# Altium project efm8sb1-dev-board.PrjPcb
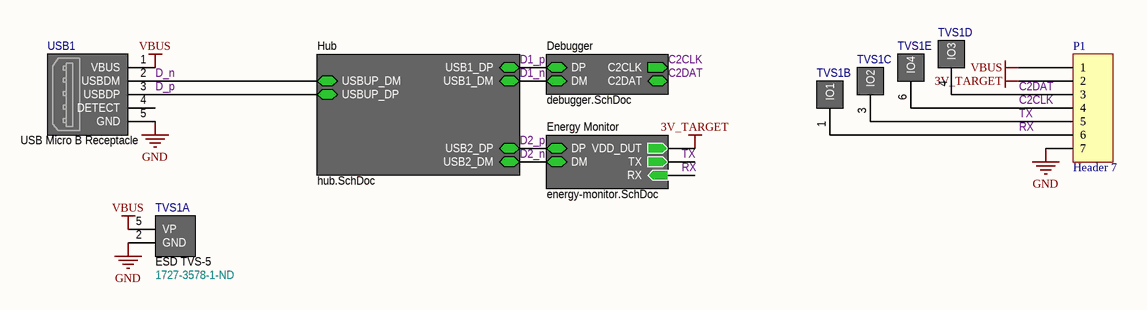
[diagram p0: efm8sb1-dev-board.SchDoc]
4 sheets, 25 parts. Net scope: hierarchical (ports join the sheet entries above them; power ports are global).
Board file: efm8sb1-dev-board.PcbDoc
Sheets:
  efm8sb1-dev-board.SchDoc
    Debugger = debugger.SchDoc
    Hub = hub.SchDoc
    Energy Monitor = energy-monitor.SchDoc

## Sheet efm8sb1-dev-board.SchDoc
size Letter; SheetNumber: 1

### Parts
P1  Header 7  [HDR1X7-PINS]
TVS1  ESD TVS-5  Supplier Part Number 1: 1727-3578-1-ND  [SOT26A-6N]  (parts A,B,C,D,E of 5)
USB1  USB Micro B Receptacle  [10118193-0001LF]

### Sub-sheets
Debugger = debugger.SchDoc: DP (bidir), DM (bidir), C2CLK (out), C2DAT (bidir)
Energy Monitor = energy-monitor.SchDoc: DP (bidir), DM (bidir), TX (out), VDD_DUT (out), RX (in)
Hub = hub.SchDoc: USB1_DP (bidir), USB1_DM (bidir), USB2_DP (bidir), USB2_DM (bidir), USBUP_DP (bidir), USBUP_DM (bidir)

### Nets
3V_TARGET: P1.2 ; sheet Energy Monitor/VDD_DUT
GND: P1.7 TVS1.2(GND) USB1.5(GND)
VBUS: P1.1 TVS1.5(VP) USB1.1(VBUS)
C2CLK: P1.4 TVS1.6(IO4) ; sheet Debugger/C2CLK
C2DAT: P1.3 TVS1.4(IO3) ; sheet Debugger/C2DAT
D1_n: sheet Debugger/DM, sheet Hub/USB1_DM
D1_p: sheet Debugger/DP, sheet Hub/USB1_DP
D2_n: sheet Hub/USB2_DM, sheet Energy Monitor/DM
D2_p: sheet Hub/USB2_DP, sheet Energy Monitor/DP
D_n: USB1.2(USBDM) ; sheet Hub/USBUP_DM
D_p: USB1.3(USBDP) ; sheet Hub/USBUP_DP
RX: P1.6 TVS1.1(IO1) ; sheet Energy Monitor/RX
TX: P1.5 TVS1.3(IO2) ; sheet Energy Monitor/TX

Not connected (* = marked no-connect by the designer): USB1 4(DETECT)

### Library data of the parts
P1 = Header 7: Header, 7-Pin; LatestRevisionDate: 17-Jul-2002; LatestRevisionNote: Re-released for DXP Platform.; Publisher: Altium Limited
TVS1 = ESD TVS-5: 5-channel ESD protection device for USB; Manufacturer Part Number 1: IP4220CZ6,125; Manufacturer Part Number 2: SRV05-4; Supplier 1: Digi-Key

## Sheet debugger.SchDoc
size Letter; SheetNumber: 4
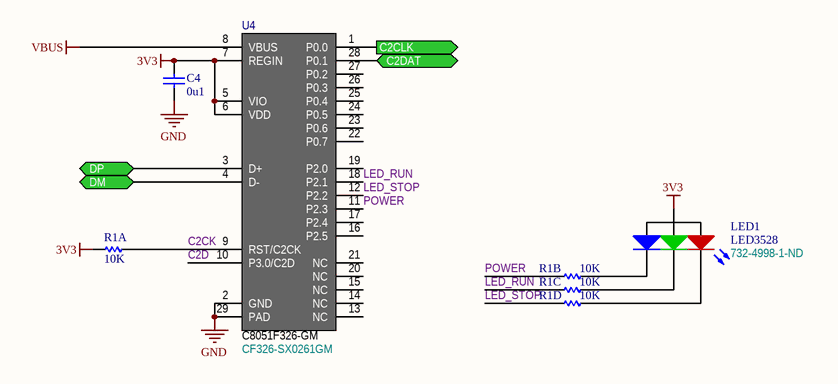
[diagram p1: debugger.SchDoc]

### Parts
C4  0u1  [CAPC1005N]
LED1  LED3528  Supplier Part Number 1: 732-4998-1-ND  [LED3528]
R1  value 10K  [RESNET_8_1206]  (hidden comment: Res Pack5)  (parts A,B,C,D of 4)
U4  C8051F326-GM  Supplier Part Number 1: CF326-SX0261GM  [QFN50P500X500-28VAN]

### Ports
C2CLK (out), C2DAT (bidir), DM (bidir), DP (bidir)

### Nets
3V3: C4.2 LED1.1(A) R1.1 U4.5(VIO) U4.6(VDD) U4.7(REGIN)
GND: C4.1 U4.2(GND) U4.29(PAD)
VBUS: U4.8(VBUS)
C2CK: R1.8 U4.9(RST/C2CK)  [project net C2CK_4]
C2CLK: U4.1(P0.0) ; port C2CLK
C2D: U4.10(P3.0/C2D)  [project net C2D_4]
C2DAT: U4.28(P0.1) ; port C2DAT
D1_n: U4.4(D-) ; port DM
D1_p: U4.3(D+) ; port DP
LED_RUN: R1.6 U4.18(P2.1)  [project net LED_RUN_4]
LED_STOP: R1.5 U4.12(P2.2)  [project net LED_STOP_4]
POWER: R1.7 U4.11(P2.3)  [project net POWER_4]
NetLED1_2: LED1.2(K_B) R1.2
NetLED1_3: LED1.3(K_R) R1.4
NetLED1_4: LED1.4(K_G) R1.3

Not connected (* = marked no-connect by the designer): U4 13(NC) 14(NC) 15(NC) 16(P2.5) 17(P2.4) 19(P2.0) 20(NC) 21(NC) 22(P0.7) 23(P0.6) 24(P0.5) 25(P0.4) 26(P0.3) 27(P0.2)

### Library data of the parts
C4 = Cap Semi: Capacitor (Semiconductor SIM Model); Published: 8-Jun-2000; LatestRevisionDate: 29-May-2009; LatestRevisionNote: IPC-7351 Footprint Added.; PackageReference: C1206; Publisher: Altium Limited; PackageDescription: Chip Capacitor
LED1 = LED_RGB: RGB LED; Published: 8-Jun-2000; LatestRevisionDate: 08-Jul-2005; LatestRevisionNote: Mech Layer 1 removed.; PackageReference: LED-0; Publisher: Altium Limited; PackageDescription: LED; 2 Leads; Supplier 1: Digi-Key
R1 = Res Pack5: Isolated Resistor Network - Parts; Sim Note: Enter the Resistance value into parameter field.; Published: 24-Mar-1999; LatestRevisionDate: 29-May-2009; LatestRevisionNote: IPC-7351 Footprint Added.; PackageReference: SOIC16; Publisher: Altium Limited; PackageDescription: 16-Pin Small Outline Integrated Circuit 1.27 mm Pitch; Code_JEDEC: MS-012-AC; Code_IPC: SOIC127P600-16
U4 = C8051F326-GM: IC MCU 8BIT 16KB FLASH 28QFN; Manufacturer: Silicon Labs; Core Processor: 8051; Core Size: 8-Bit; Speed: 25MHz; Connectivity: UART/USART, USB; Peripherals: POR; Number of I/O: 15; Program Memory Size: 16KB (16K x 8); RAM Size: 1.5K x 8; Voltage - Supply (Vcc/Vdd): 2.7 V ~ 3.6 V; Oscillator Type: Internal; Supplier 1: Digi-Key; Manufacturer Part Number: C8051F326-GM; RoHS: RoHS Compliant; Category: Integrated Circuits (ICs); Stock 1: 1461; Pricing 1: 1=1.42, 25=1.3632, 100=1.3108, 1000=1.26561 (USD); Packaging: Tube; Part Status: Active; Program Memory Type: FLASH; EEPROM Size: -; Data Converters: -; Operating Temperature: -40°C ~ 85°C (TA); Package / Case: 28-VFQFN Exposed Pad; Supplier Device Package: 28-QFN (5x5); ComponentLink1URL: http://www.silabs.com/documents/public/data-sheets/C8051F326.pdf; ComponentLink1Description: http://www.silabs.com/documents/public/data-sheets/C8051F326.pdf

## Sheet hub.SchDoc
size Letter; SheetNumber: 2
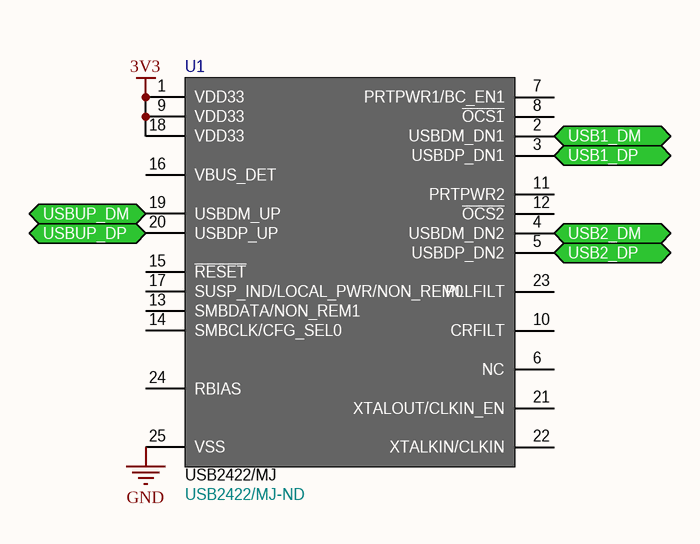
[diagram p2: hub.SchDoc]

### Parts
U1  USB2422/MJ  Supplier Part Number 1: USB2422/MJ-ND  [QFN50P400X400-24V2N]

### Ports
USB1_DM (bidir), USB1_DP (bidir), USB2_DM (bidir), USB2_DP (bidir), USBUP_DM (bidir), USBUP_DP (bidir)

### Nets
3V3: U1.1(VDD33) U1.9(VDD33) U1.18(VDD33)
GND: U1.25(VSS)
D1_n: U1.2(USBDM_DN1) ; port USB1_DM
D1_p: U1.3(USBDP_DN1) ; port USB1_DP
D2_n: U1.4(USBDM_DN2) ; port USB2_DM
D2_p: U1.5(USBDP_DN2) ; port USB2_DP
D_n: U1.19(USBDM_UP) ; port USBUP_DM
D_p: U1.20(USBDP_UP) ; port USBUP_DP

Not connected (* = marked no-connect by the designer): U1 6(NC) 7(PRTPWR1/BC_EN1) 8(~{OCS1}) 10(CRFILT) 11(PRTPWR2) 12(~{OCS2}) 13(SMBDATA/NON_REM1) 14(SMBCLK/CFG_SEL0) 15(~{RESET}) 16(VBUS_DET) 17(SUSP_IND/LOCAL_PWR/NON_REM0) 21(XTALOUT/CLKIN_EN) 22(XTALKIN/CLKIN) 23(PLLFILT) 24(RBIAS)

### Library data of the parts
U1 = USB2422/MJ: IC HUB CTLR USB 2.0 24QFN; Manufacturer: Microchip Technology; Function: Hub Controller; Standards: USB 2.0; Voltage - Supply: 3.3V; Supplier 1: Digi-Key; Manufacturer Part Number: USB2422/MJ; RoHS: RoHS Compliant; Category: Integrated Circuits (ICs); Stock 1: 2537; Pricing 1: 1=1.6, 25=1.3288, 100=1.2875 (USD); Packaging: Tray; Part Status: Active; Protocol: USB; Interface: USB; Current - Supply: -; Operating Temperature: 0°C ~ 70°C; Package / Case: 24-VFQFN Exposed Pad; Supplier Device Package: 24-QFN (4x4); Base Part Number: USB2422; ComponentLink1URL: http://www.microchip.com/mymicrochip/filehandler.aspx?ddocname=en566992; ComponentLink1Description: http://www.microchip.com/mymicrochip/filehandler.aspx?ddocname=en566992

## Sheet energy-monitor.SchDoc
size Letter; SheetNumber: 3
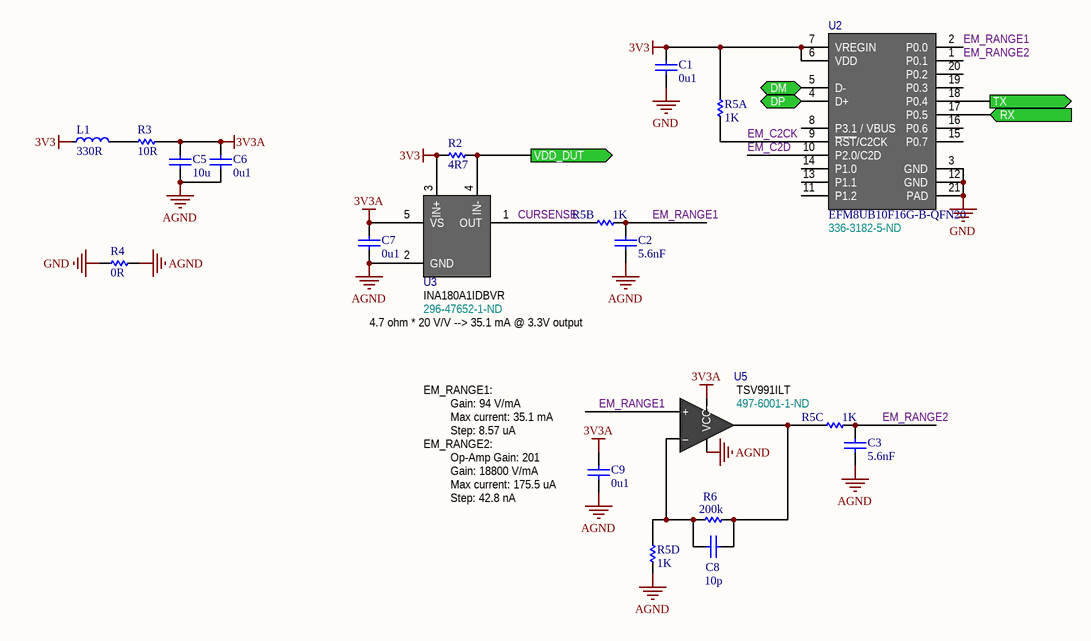
[diagram p3: energy-monitor.SchDoc]

### Parts
C1  0u1  [CAPC1005N]
C2  5.6nF  [CAPC1005N]
C3  5.6nF  [CAPC1005N]
C5  10u  [CAPC1608N]
C6  0u1  [CAPC1005N]
C7  0u1  [CAPC1005N]
C8  10p  [CAPC1005N]
C9  0u1  [CAPC1005N]
L1  value 330R  [INDC1005N]  (hidden comment: Inductor)
R2  4R7  [RESC1608N]
R3  10R  [RESC1005N]
R4  0R  [RESC1005N]
R5  value 1K  [RESNET_8_1206]  (hidden comment: Res Pack5)  (parts A,B,C,D of 4)
R6  200k  [RESC1005N]
U2  EFM8UB10F16G-B-QFN20  Supplier Part Number 1: 336-3182-5-ND  [QFN50P300X300X90-20N]
U3  INA180A1IDBVR  Supplier Part Number 1: 296-47652-1-ND  [SOT23-5AN]
U5  TSV991ILT  Supplier Part Number 1: 497-6001-1-ND  [SOT23-5AN]

### Ports
DM (bidir), DP (bidir), RX (in), TX (out), VDD_DUT (out)

### Nets
3V3: C1.2 L1.1 R2.1 R5.8 U2.6(VDD) U2.7(VREGIN) U3.3(IN+)
3V3A: C5.2 C6.2 C7.2 C9.2 R3.2 U3.5(VS) U5.5(VCC+)
3V_TARGET: R2.2 U3.4(IN-) ; port VDD_DUT
AGND: C2.1 C3.1 C5.1 C6.1 C7.1 C9.1 R4.2 R5.5 U3.2(GND) U5.2(VCC-)
GND: C1.1 R4.1 U2.3(GND) U2.12(GND) U2.21(PAD)
CURSENSE: R5.7 U3.1(OUT)  [project net CURSENSE_3]
D2_n: U2.5(D-) ; port DM
D2_p: U2.4(D+) ; port DP
EM_C2CK: R5.1 U2.9(~{RST}/C2CK)  [project net EM_C2CK_3]
EM_C2D: U2.10(P2.0/C2D)  [project net EM_C2D_3]
EM_RANGE1: C2.2 R5.2 U2.2(P0.0) U5.3(+)  [project net EM_RANGE1_3]
EM_RANGE2: C3.2 R5.3 U2.1(P0.1)  [project net EM_RANGE2_3]
RX: U2.17(P0.5) ; port RX
TX: U2.18(P0.4) ; port TX
NetC8_1: C8.1 R5.4 R6.1 U5.4(–)
NetC8_2: C8.2 R5.6 R6.2 U5.1(OUT)
NetL1_2: L1.2 R3.1

Not connected (* = marked no-connect by the designer): U2 8(P3.1_/_VBUS) 11(P1.2) 13(P1.1) 14(P1.0) 15(P0.7) 16(P0.6) 19(P0.3) 20(P0.2)

### Notes on the sheet
- 4.7 ohm * 20 V/V --> 35.1 mA @ 3.3V output
- EM_RANGE1:
- (near C9) Max current: 35.1 mA
- Gain: 94 V/mA
- Step: 8.57 uA
- EM_RANGE2:
- (near C9) Op-Amp Gain: 201
- (near C9) Gain: 18800 V/mA
- (near C9) Max current: 175.5 uA
- Step: 42.8 nA

### Library data of the parts
C1-C3 C5-C9 = Cap Semi: Capacitor (Semiconductor SIM Model); Published: 8-Jun-2000; LatestRevisionDate: 29-May-2009; LatestRevisionNote: IPC-7351 Footprint Added.; PackageReference: C1206; Publisher: Altium Limited; PackageDescription: Chip Capacitor
L1 = Inductor: Code_IEC: 1005; Published: 8-Jun-2000; LatestRevisionDate: 29-May-2009; LatestRevisionNote: IPC-7351 Footprint Added.; PackageReference: 0402-A; Publisher: Altium Limited; PackageDescription: Chip Inductor; Code_JEITA: 0402
R2-R4 R6 = Res Semi: Semiconductor Resistor; Published: 8-Jun-2000; LatestRevisionDate: 17-Jul-2002; LatestRevisionNote: Re-released for DXP Platform.; PackageReference: AXIAL-0.5; Publisher: Altium Limited; PackageDescription: Axial Device, Thru-Hole; 2 Leads; 0.5 in Pin Spacing
R5 = Res Pack5: as R1 on sheet debugger; Published: 24-Mar-1999; LatestRevisionDate: 29-May-2009; LatestRevisionNote: IPC-7351 Footprint Added.; PackageReference: SOIC16; Publisher: Altium Limited; PackageDescription: 16-Pin Small Outline Integrated Circuit 1.27 mm Pitch; Code_JEDEC: MS-012-AC; Code_IPC: SOIC127P600-16
U2 = EFM8UB10F16G-B-QFN20: IC MCU 16KB 20QFN; Manufacturer: Silicon Labs; Core Size: 8-Bit; Speed: 50MHz; Connectivity: I²C, SMBus, SPI, UART/USART, USB; Peripherals: Brown-out Detect/Reset, POR, PWM, WDT; Number of I/O: 13; Program Memory Size: 16KB (16K x 8); Program Memory Type: FLASH; RAM Size: 2.25K x 8; Voltage - Supply (Vcc/Vdd): 2.2 V ~ 5.25 V; Data Converters: A/D 11x12b; Oscillator Type: Internal; Supplier 1: Digi-Key; Manufacturer Part Number: EFM8UB10F16G-B-QFN20; RoHS: RoHS Compliant; Category: Integrated Circuits (ICs); Stock 1: 75; Pricing 1: 1=1.18, 25=1.0832, 100=0.9848, 1000=0.88628 (USD); Packaging: Tube; Core Processor: CIP-51 8051; EEPROM Size: -; Operating Temperature: -40°C ~ 85°C; Package / Case: 20-UFQFN Exposed Pad; Supplier Device Package: 20-QFN (3x3); ComponentLink1URL: http://www.silabs.com/Support%20Documents/TechnicalDocs/EFM8UB1_DataSheet.pdf; ComponentLink1Description: http://www.silabs.com/Support%20Documents/TechnicalDocs/EFM8UB1_DataSheet.pdf
U3 = INA180A1IDBVR: Manufacturer: Texas Instruments; Amplifier Type: Current Sense; Output Type: Rail-to-Rail; Slew Rate: 2 V/µs; Current - Supply: 260µA; Voltage - Supply, Single/Dual (±): 2.7 V ~ 5.5 V; Supplier 1: Digi-Key; Manufacturer Part Number: INA180A1IDBVR; RoHS: RoHS Compliant; Category: Integrated Circuits (ICs); Stock 1: 1952; Pricing 1: 1=0.6, 10=0.51, 100=0.3807, 500=0.29912, 1000=0.23113 (USD); Packaging: Cut Tape (CT); Part Status: Active; Operating Temperature: -40°C ~ 125°C; Mounting Type: Surface Mount; Package / Case: SC-74A, SOT-753; Supplier Device Package: SOT-23-5; ComponentLink1URL: http://www.ti.com/lit/ds/symlink/ina180.pdf; ComponentLink1Description: http://www.ti.com/lit/ds/symlink/ina180.pdf
U5 = TSV991ILT: IC OPAMP GP 20MHZ RRO SOT23-5; Manufacturer: STMicroelectronics; Amplifier Type: General Purpose; Output Type: Rail-to-Rail; Slew Rate: 10 V/µs; Current - Supply: 820µA; Voltage - Supply, Single/Dual (±): 2.5 V ~ 5.5 V; Supplier 1: Digi-Key; Manufacturer Part Number: TSV991ILT; RoHS: RoHS Compliant; Category: Integrated Circuits (ICs); Stock 1: 2760; Pricing 1: 1=0.76, 10=0.673, 100=0.516, 500=0.40788, 1000=0.3263 (USD); Packaging: Cut Tape (CT); Part Status: Active; Operating Temperature: -40°C ~ 125°C; Mounting Type: Surface Mount; Package / Case: SC-74A, SOT-753; Supplier Device Package: SOT-23-5; Base Part Number: TSV991; ComponentLink1URL: http://www.st.com/content/ccc/resource/technical/document/datasheet/d8/e3/a5/aa/8f/d7/42/67/CD00144611.pdf/files/CD00144611.pdf/jcr:content/translations/en.CD00144611.pdf; ComponentLink1Description: http://www.st.com/content/ccc/resource/technical/document/datasheet/d8/e3/a5/aa/8f/d7/42/67/CD00144611.pdf/files/CD00144611.pdf/jcr:content/translations/en.CD00144611.pdf

## Nets that join several sheets
3V3: debugger (6 pins), hub (U1.1 U1.9 U1.18), energy-monitor (7 pins)
3V_TARGET: efm8sb1-dev-board (P1.2), energy-monitor (R2.2 U3.4)
GND: efm8sb1-dev-board (P1.7 TVS1.2 USB1.5), debugger (C4.1 U4.2 U4.29), hub (U1.25), energy-monitor (5 pins)
VBUS: efm8sb1-dev-board (P1.1 TVS1.5 USB1.1), debugger (U4.8)
C2CLK: efm8sb1-dev-board (P1.4 TVS1.6), debugger (U4.1)
C2DAT: efm8sb1-dev-board (P1.3 TVS1.4), debugger (U4.28)
D1_n: debugger (U4.4), hub (U1.2)
D1_p: debugger (U4.3), hub (U1.3)
D2_n: hub (U1.4), energy-monitor (U2.5)
D2_p: hub (U1.5), energy-monitor (U2.4)
D_n: efm8sb1-dev-board (USB1.2), hub (U1.19)
D_p: efm8sb1-dev-board (USB1.3), hub (U1.20)
RX: efm8sb1-dev-board (P1.6 TVS1.1), energy-monitor (U2.17)
TX: efm8sb1-dev-board (P1.5 TVS1.3), energy-monitor (U2.18)